# Altium schematic sheet BlinkPico.SchDoc
size A4
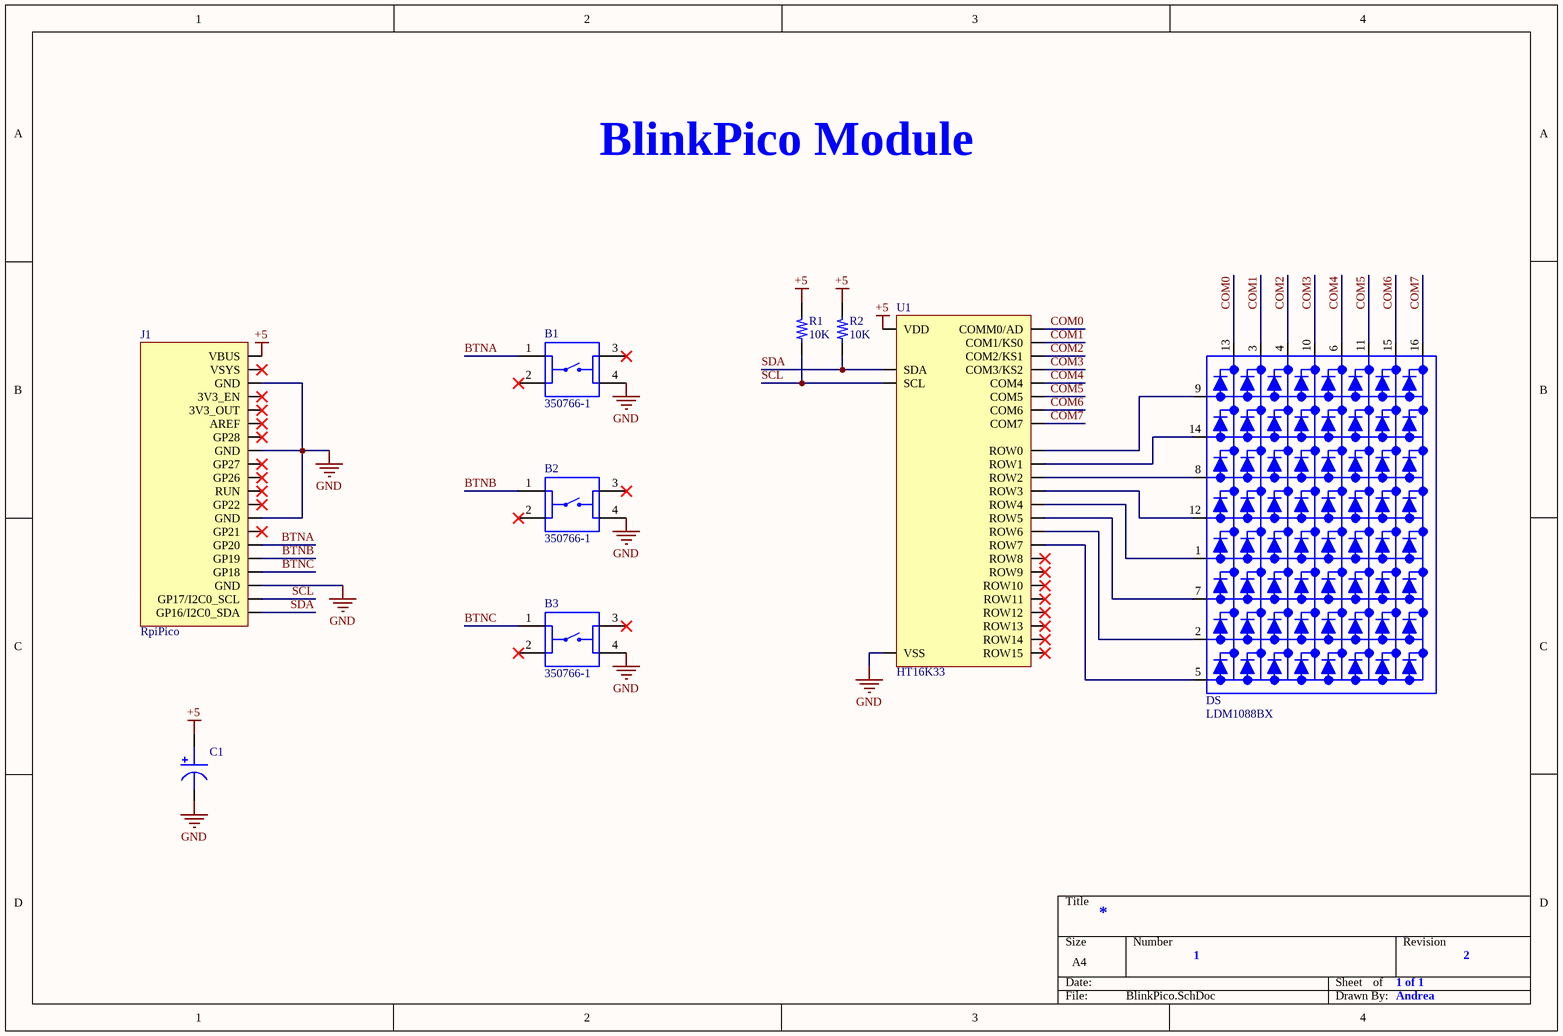
[diagram p0: BlinkPico.SchDoc]

## Parts
B1  350766-1  [PUSH_BTN]
B2  350766-1  [PUSH_BTN]
B3  350766-1  [PUSH_BTN]
C1  TCP1A106M8R  [C0805]  (value not drawn)
DS  LDM1088BX  [LED_MATRIX_8X8]
J1  RpiPico  [PICO_ADAPTER]
R1  10K  [R0805]
R2  10K  [R0805]
U1  HT16K33  [SOP28]

## Nets
+5: C1.1 J1.1(VBUS) R1.2 R2.2 U1.28(VDD)
GND: B1.4 B2.4 B3.4 C1.2 J1.3(GND) J1.8(GND) J1.13(GND) J1.18(GND) U1.1(VSS)
BTNA: B1.1 J1.15(GP20)
BTNB: B2.1 J1.16(GP19)
BTNC: B3.1 J1.17(GP18)
COM0: DS.13(ANODE_COLUMN_1) U1.2(COMM0/AD)
COM1: DS.3(ANODE_COLUMN_2) U1.3(COM1/KS0)
COM2: DS.4(ANODE_COLUMN_3) U1.4(COM2/KS1)
COM3: DS.10(ANODE_COLUMN_4) U1.5(COM3/KS2)
COM4: DS.6(ANODE_COLUMN_5) U1.6(COM4)
COM5: DS.11(ANODE_COLUMN_6) U1.7(COM5)
COM6: DS.15(ANODE_COLUMN_7) U1.8(COM6)
COM7: DS.16(ANODE_COLUMN_8) U1.9(COM7)
SCL: J1.19(GP17/I2C0_SCL) R1.1 U1.26(SCL)
SDA: J1.20(GP16/I2C0_SDA) R2.1 U1.27(SDA)
NetDS_1: DS.1(CATHODE_ROW_5) U1.21(ROW4)
NetDS_2: DS.2(CATHODE_ROW_7) U1.19(ROW6)
NetDS_5: DS.5(CATHODE_ROW_8) U1.18(ROW7)
NetDS_7: DS.7(CATHODE_ROW_6) U1.20(ROW5)
NetDS_8: DS.8(CATHODE_ROW_3) U1.23(ROW2)
NetDS_9: DS.9(CATHODE_ROW_1) U1.25(ROW0)
NetDS_12: DS.12(CATHODE_ROW_4) U1.22(ROW3)
NetDS_14: DS.14(CATHODE_ROW_2) U1.24(ROW1)

Not connected (* = marked no-connect by the designer): B1 2* 3*; B2 2* 3*; B3 2* 3*; J1 2(VSYS)* 4(3V3_EN)* 5(3V3_OUT)* 6(AREF)* 7(GP28)* 9(GP27)* 10(GP26)* 11(RUN)* 12(GP22)* 14(GP21)*; U1 10(ROW15)* 11(ROW14)* 12(ROW13)* 13(ROW12)* 14(ROW11)* 15(ROW10)* 16(ROW9)* 17(ROW8)*

## Notes on the sheet
- BlinkPico Module
- 1
- 1 of 1
- 2
- Andrea

## Library data of the parts
B1-B3 = PUSH_BTN: Connector, Soft Shell; Universal MATE-N-LOK; 3; Plug; Nylon; Natural; 19 A; Manufacturer: TE Connectivity; Gender: Male; Sealable: No (Without); VDE Tested: Yes; Number of Positions: 3; Connector System: Wire-to-Wire; Voltage Rating: 600V; Current Rating: 19A; Insulation Resistance: 1GR; Contact Resistance: 3.5MR; Wire Gauge (Max): 30AWG; Wire Gauge (Min): 10AWG; Pitch: 6.35mm; Approvals: CSA; Supplier 1: Digi-Key; Manufacturer Part Number: 350766-1; Stock 1: 60989; Mount: Free Hanging; Number of Pins: 3; Material: Nylon; Color: White; Housing Color: White; Housing Material: Nylon; Contact Material: Bronze; Insulation Material: Nylon; Contact Plating: Tin; Min Operating Temperature: -67°C; Max Operating Temperature: 221°C; Packaging: Bulk; Package Quantity: 1; Series: Universal MATE-N-LOK; Termination: Crimp; Orientation: Straight; Connector Type: Plug; Contact Type: Male or Female; Fastening Type: Latch; Number of Contacts: 3; Contact Gender: Male; Max Voltage Rating (AC): 600V; Number of Rows: 1; Number of Circuits: 3; Contact Retention: No (Without); Max Current Rating: 19A; Width: 14.73mm; Height: 14.73mm; Depth: 27.43mm; Wire/Cable Gauge: 30AWG; REACH SVHC: No SVHC; Lead Free: Lead Free; ELV: Compliant; Flammability Rating: UL94 V-0; ComponentLink1URL: https://datasheet.ciiva.com/30171/eng-cat-124962-0304-371-30171553.pdf?src-supplier=Onlinecomponents.com; ComponentLink1Description: https://datasheet.ciiva.com/30171/eng-cat-124962-0304-371-30171553.pdf?src-supplier=Onlinecomponents.com; ComponentLink2URL: https://datasheet.ciiva.com/11717/0900766b8012272c-11717976.pdf?src-supplier=RSComponents; ComponentLink2Description: https://datasheet.ciiva.com/11717/0900766b8012272c-11717976.pdf?src-supplier=RSComponents; ComponentLink3URL: https://datasheet.ciiva.com/16207/eng-cs-82181-softshell-standard-density-0508-16207256.pdf?src-supplier=Future+Electronics; ComponentLink3Description: https://datasheet.ciiva.com/16207/eng-cs-82181-softshell-standard-density-0508-16207256.pdf?src-supplier=Future+Electronics; ComponentLink4URL: https://datasheet.ciiva.com/19473/495744-19473028.pdf?src-supplier=Jameco; ComponentLink4Description: https://datasheet.ciiva.com/19473/495744-19473028.pdf?src-supplier=Jameco; ComponentLink5URL: https://datasheet.ciiva.com/29266/749745-da-01-en-steckgehaeuse-einreihig-3pol-29266513.pdf?src-supplier=Conrad; ComponentLink5Description: https://datasheet.ciiva.com/29266/749745-da-01-en-steckgehaeuse-einreihig-3pol-29266513.pdf?src-supplier=Conrad; ComponentLink6URL: https://datasheet.ciiva.com/41447/001196492-da-01-en-steckergehaeuse-0-0350766-1-41447693.pdf?src-supplier=Conrad; ComponentLink6Description: https://datasheet.ciiva.com/41447/001196492-da-01-en-steckergehaeuse-0-0350766-1-41447693.pdf?src-supplier=Conrad; ComponentLink7URL: https://datasheet.ciiva.com/758/eng-cd-350766-y3-758580.pdf?src-supplier=Digi-Key; ComponentLink7Description: https://datasheet.ciiva.com/758/eng-cd-350766-y3-758580.pdf?src-supplier=Digi-Key; ComponentLink8URL: https://datasheet.ciiva.com/15178/getdatasheetpartid-85356-15178476.pdf?src-supplier=Verical; ComponentLink8Description: https://datasheet.ciiva.com/15178/getdatasheetpartid-85356-15178476.pdf?src-supplier=Verical; ComponentLink9URL: https://datasheet.ciiva.com/25907/eng-cs-82181-softshell-standard-density-0508-25907982.pdf?src-supplier=Avnet+Europe; ComponentLink9Description: https://datasheet.ciiva.com/25907/eng-cs-82181-softshell-standard-density-0508-25907982.pdf?src-supplier=Avnet+Europe; ComponentLink10URL: https://datasheet.ciiva.com/8002/1492314-8002440.pdf?src-supplier=Element14; ComponentLink10Description: https://datasheet.ciiva.com/8002/1492314-8002440.pdf?src-supplier=Element14; ComponentLink11URL: https://datasheet.octopart.com/350766-1-TE-Connectivity-datasheet-11077730.pdf?src-supplier=TE+Connectivity; ComponentLink11Description: https://datasheet.octopart.com/350766-1-TE-Connectivity-datasheet-11077730.pdf?src-supplier=TE+Connectivity; ComponentLink12URL: https://sigma.octopart.com/13728446/technical_drawing/TE-Connectivity-350766-1.pdf?src-supplier=TE+Connectivity; ComponentLink12Description: https://sigma.octopart.com/13728446/technical_drawing/TE-Connectivity-350766-1.pdf?src-supplier=TE+Connectivity; ComponentLink13URL: https://sigma.octopart.com/13532795/instruction_sheet/TE-Connectivity-350766-1.pdf?src-supplier=TE+Connectivity; ComponentLink13Description: https://sigma.octopart.com/13532795/instruction_sheet/TE-Connectivity-350766-1.pdf?src-supplier=TE+Connectivity; ComponentLink14URL: https://sigma.octopart.com/14655065/instruction_sheet/TE-Connectivity-350766-1.pdf?src-supplier=TE+Connectivity; ComponentLink14Description: https://sigma.octopart.com/14655065/instruction_sheet/TE-Connectivity-350766-1.pdf?src-supplier=TE+Connectivity; ComponentLink15URL: https://sigma.octopart.com/55598913/instruction_sheet/TE-Connectivity-350766-1.pdf?src-supplier=TE+Connectivity; ComponentLink15Description: https://sigma.octopart.com/55598913/instruction_sheet/TE-Connectivity-350766-1.pdf?src-supplier=TE+Connectivity; ComponentLink16URL: https://sigma.octopart.com/100063074/technical_drawing/TE-Connectivity-350766-1.pdf?src-supplier=TE+Connectivity; ComponentLink16Description: https://sigma.octopart.com/100063074/technical_drawing/TE-Connectivity-350766-1.pdf?src-supplier=TE+Connectivity; ComponentLink17URL: https://datasheet.octopart.com/350766-1-Agastat-datasheet-13523607.pdf?src-supplier=TE+Connectivity; ComponentLink17Description: https://datasheet.octopart.com/350766-1-Agastat-datasheet-13523607.pdf?src-supplier=TE+Connectivity; ComponentLink18URL: https://datasheet.octopart.com/350766-1-TE-Connectivity-datasheet-93676928.pdf?src-supplier=Master+Electronics; ComponentLink18Description: https://datasheet.octopart.com/350766-1-TE-Connectivity-datasheet-93676928.pdf?src-supplier=Master+Electronics; ComponentLink19URL: https://datasheet.octopart.com/350766-1-TE-Connectivity-datasheet-136661981.pdf?src-supplier=Jameco; ComponentLink19Description: https://datasheet.octopart.com/350766-1-TE-Connectivity-datasheet-136661981.pdf?src-supplier=Jameco; ComponentLink20URL: https://datasheet.octopart.com/350766-1-TE-Connectivity-datasheet-7610435.pdf?src-supplier=Jameco; ComponentLink20Description: https://datasheet.octopart.com/350766-1-TE-Connectivity-datasheet-7610435.pdf?src-supplier=Jameco; ComponentLink21URL: https://sigma.octopart.com/147322513/technical_drawing/TE-Connectivity-350766-1.pdf?src-supplier=Sager+Electronics; ComponentLink21Description: https://sigma.octopart.com/147322513/technical_drawing/TE-Connectivity-350766-1.pdf?src-supplier=Sager+Electronics; ComponentLink22URL: https://sigma.octopart.com/137343799/technical_drawing/TE-Connectivity-350766-1.pdf?src-supplier=Sager+Electronics; ComponentLink22Description: https://sigma.octopart.com/137343799/technical_drawing/TE-Connectivity-350766-1.pdf?src-supplier=Sager+Electronics; ComponentLink23URL: https://datasheet.octopart.com/350766-1-TE-Connectivity-datasheet-575922.pdf?src-supplier=TME; ComponentLink23Description: https://datasheet.octopart.com/350766-1-TE-Connectivity-datasheet-575922.pdf?src-supplier=TME; ComponentLink24URL: https://datasheet.octopart.com/350766-1-TE-Connectivity-datasheet-62135508.pdf?src-supplier=TME; ComponentLink24Description: https://datasheet.octopart.com/350766-1-TE-Connectivity-datasheet-62135508.pdf?src-supplier=TME; ComponentLink25URL: https://datasheet.octopart.com/350766-1-TE-Connectivity-datasheet-20739004.pdf?src-supplier=Allied+Electronics; ComponentLink25Description: https://datasheet.octopart.com/350766-1-TE-Connectivity-datasheet-20739004.pdf?src-supplier=Allied+Electronics; ComponentLink26URL: https://datasheet.octopart.com/350766-1-Tyco-Electronics-datasheet-75719.pdf?src-supplier=Allied+Electronics; ComponentLink26Description: https://datasheet.octopart.com/350766-1-Tyco-Electronics-datasheet-75719.pdf?src-supplier=Allied+Electronics; ComponentLink27URL: https://datasheet.octopart.com/350766-1-Tyco-Electronics-datasheet-9747055.pdf?src-supplier=Allied+Electronics; ComponentLink27Description: https://datasheet.octopart.com/350766-1-Tyco-Electronics-datasheet-9747055.pdf?src-supplier=Allied+Electronics; ComponentLink28URL: https://datasheet.octopart.com/350766-1-Tyco-Electronics-datasheet-504958.pdf?src-supplier=Farnell; ComponentLink28Description: https://datasheet.octopart.com/350766-1-Tyco-Electronics-datasheet-504958.pdf?src-supplier=Farnell; ComponentLink29URL: https://datasheet.octopart.com/350766-1-Tyco-Electronics-datasheet-5317283.pdf?src-supplier=Farnell; ComponentLink29Description: https://datasheet.octopart.com/350766-1-Tyco-Electronics-datasheet-5317283.pdf?src-supplier=Farnell; ComponentLink30URL: https://datasheet.octopart.com/350766-1-Agastat-datasheet-14718520.pdf?src-supplier=Farnell; ComponentLink30Description: https://datasheet.octopart.com/350766-1-Agastat-datasheet-14718520.pdf?src-supplier=Farnell; ComponentLink31URL: https://datasheet.octopart.com/350766-1-Tyco-Electronics-datasheet-657038.pdf?src-supplier=Future+Electronics; ComponentLink31Description: https://datasheet.octopart.com/350766-1-Tyco-Electronics-datasheet-657038.pdf?src-supplier=Future+Electronics; ComponentLink32URL: https://datasheet.octopart.com/350766-1-TE-Connectivity---AMP-datasheet-5333557.pdf?src-supplier=Electro+Sonic; ComponentLink32Description: https://datasheet.octopart.com/350766-1-TE-Connectivity---AMP-datasheet-5333557.pdf?src-supplier=Electro+Sonic; ComponentLink33URL: https://sigma.octopart.com/141437736/technical_drawing/TE-Connectivity---AMP-350766-1.pdf?src-supplier=Upverter; ComponentLink33Description: https://sigma.octopart.com/141437736/technical_drawing/TE-Connectivity---AMP-350766-1.pdf?src-supplier=Upverter; Supplier Part Number 1: A14280-ND; Pricing 1: 1 = 0.55000, 10 = 0.47900, 25 = 0.43840, 50 = 0.41240, 100 = 0.39530, 250 = 0.36088, 500 = 0.34370, 1000 = 0.28356, 2500 = 0.25778 (USD)
C1 = C0805_10U_TANTAL: Cap Tant Solid 10uF 10V P CASE 20% (2 X 1.25 X 1.2mm) Inward L SMD 2012-12 125C T/R; Manufacturer: Rohm; Supplier 1: Digi-Key; Manufacturer Part Number: TCP1A106M8R; RoHS: Yes; Category: Tantalum Capacitors; Stock 1: 13672; Mount: Surface Mount; Case/Package: 0805; Case Code (Metric): 2012; Case Code (Imperial): 0805; Min Operating Temperature: -55°C; Max Operating Temperature: 125°C; Package Quantity: 3000; Packaging: Tape and Reel; Capacitance: 10uF; Tolerance: 20%; Voltage Rating: 10V; Features: General Purpose; Series: TC; Construction: Flat; Length: 0.079inch; Width: 0.049inch; Height - Seated (Max): 0.047inch; Depth: 1.25mm; Radiation Hardening: No; Lead Free: Lead Free; RoHS Compliant: Yes; ComponentLink1URL: https://datasheet.ciiva.com/16493/tc-p-16493678.pdf?src-supplier=Future+Electronics; ComponentLink1Description: https://datasheet.ciiva.com/16493/tc-p-16493678.pdf?src-supplier=Future+Electronics; Supplier Part Number 1: 511-1685-1-ND; Pricing 1: 1=0.61000, 10=0.43400, 50=0.32800, 100=0.28570, 500=0.21160, 1000=0.17986 (USD)
DS = LED_MATRIX: DISPLAY, DOT MATRIX, 0.8, 8X8, GREEN; Display Dots x Lines: 8 x 8; LED Colour: Red; MF: Kingbright; MP: TA08-81GWA; Value: *; SnapEDA_Link: https://www.snapeda.com/parts/TA08-81GWA/Kingbright/view-part/553394/?ref=snap; Price: None; Availability: Unavailable; Package: DIP-16 Kingbright; ComponentLink1Description: Devicemart; ComponentLink1URL: https://www.devicemart.co.kr/goods/view?no=1287093
J1 = PICO_ADAPTER
R1 R2 = R0805_10K: Res Thick Film 0805 10K Ohm 5% 1/8W ±100ppm/°C Molded SMD Paper T/R; Manufacturer: Yageo; Manufacturer Part Number: RC0805JR-0710KL; Resistance: 10kR; Power Rating: 125mW; Voltage Rating: 150V; Supplier 1: Digi-Key; RoHS: Yes; Category: Chip SMD Resistors; Stock 1: 1237768; Case/Package: 0805; Case Code (Imperial): 0805; Case Code (Metric): 2012; Contact Plating: Tin,Matte; Size Code: 0805; Min Operating Temperature: -55°C; Max Operating Temperature: 155°C; Tolerance: 5%; Packaging: Tape and Reel; Termination: SMD/SMT; Resistor Type: Thick Film; Temperature Coefficient: 100ppm/°C; Features: Moisture Resistant; Series: RC; Max Power Dissipation: 125mW; Number of Terminations: 2; Resistance Tolerance: 5%; Construction: Rectangular; Length: 2mm; Width: 1.25mm; Height: 0.5mm; Depth: 1.25mm; Radiation Hardening: No; REACH SVHC: Unknown; Military Standard: Not; Lead Free: Lead Free; RoHS Compliant: Yes; ComponentLink1URL: https://datasheet.ciiva.com/7941/444164-7941870.pdf?src-supplier=Element14; ComponentLink1Description: https://datasheet.ciiva.com/7941/444164-7941870.pdf?src-supplier=Element14; ComponentLink2URL: https://datasheet.ciiva.com/7941/444164-7941871.pdf?src-supplier=Element14; ComponentLink2Description: https://datasheet.ciiva.com/7941/444164-7941871.pdf?src-supplier=Element14; ComponentLink3URL: https://datasheet.ciiva.com/7983/444164-7983765.pdf?src-supplier=Element14; ComponentLink3Description: https://datasheet.ciiva.com/7983/444164-7983765.pdf?src-supplier=Element14; Supplier Part Number 1: 311-10KARCT-ND; Pricing 1: 1=0.10000, 10=0.03600, 100=0.01450, 1000=0.00652, 2500=0.00566 (USD)